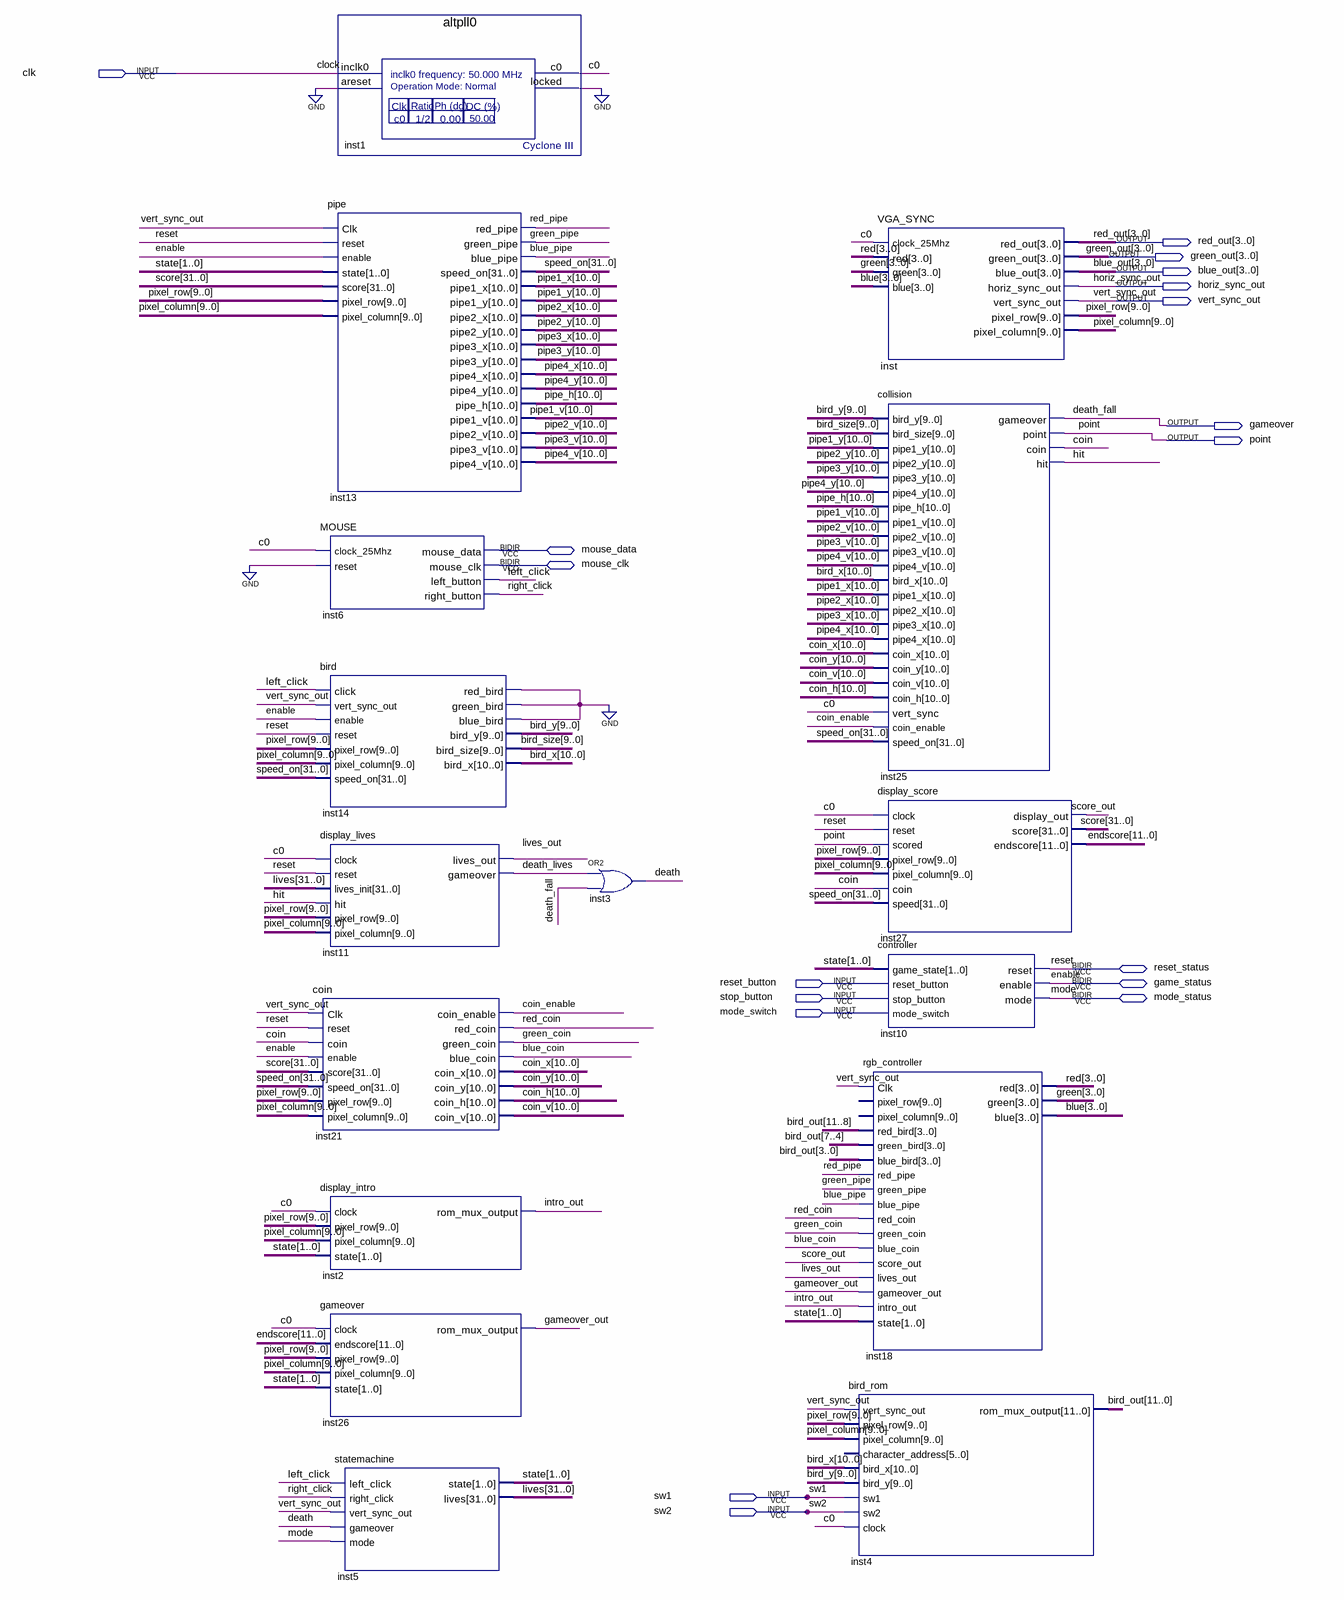
[diagram p0: schematic sheet]
// Quartus schematic game.bdf as structural Verilog: 16 symbols, 18 pins
module game (
  input  clk,
  input  reset_button,
  input  stop_button,
  input  mode_switch,
  input  sw1,
  input  sw2,
  inout  mouse_data,
  inout  mouse_clk,
  inout  reset_status,
  inout  game_status,
  inout  mode_status,
  output [3:0] red_out,
  output [3:0] green_out,
  output [3:0] blue_out,
  output horiz_sync_out,
  output vert_sync_out,
  output gameover,
  output point
);

  wire blue_coin, blue_pipe, c0, coin, coin_enable, death, death_lives, gameover_out, green_coin, green_pipe,
       hit, inst1_locked, inst14_red_bird, intro_out, left_click, lives_out, red_coin, red_pipe, right_click,
       score_out;
  wire [1:0] state;
  wire [3:0] blue, green, red;
  wire [9:0] bird_size, bird_y, pixel_column, pixel_row;
  wire [10:0] bird_x, coin_h, coin_v, coin_x, coin_y, pipe1_v, pipe1_x, pipe1_y, pipe2_v, pipe2_x, pipe2_y,
       pipe3_v, pipe3_x, pipe3_y, pipe4_v, pipe4_x, pipe4_y, pipe_h;
  wire [11:0] bird_out, endscore;
  wire [31:0] lives, score, speed_on;

  altpll0 inst1 (.inclk0(clk), .areset(1'b0), .c0(c0), .locked(inst1_locked));
  pipe inst13 (
    .Clk(vert_sync_out), .reset(reset_status), .enable(game_status), .state(state), .score(score),
    .pixel_row(pixel_row), .pixel_column(pixel_column), .red_pipe(red_pipe), .green_pipe(green_pipe),
    .blue_pipe(blue_pipe), .speed_on(speed_on), .pipe1_x(pipe1_x), .pipe1_y(pipe1_y), .pipe2_x(pipe2_x),
    .pipe2_y(pipe2_y), .pipe3_x(pipe3_x), .pipe3_y(pipe3_y), .pipe4_x(pipe4_x), .pipe4_y(pipe4_y),
    .pipe_h(pipe_h), .pipe1_v(pipe1_v), .pipe2_v(pipe2_v), .pipe3_v(pipe3_v), .pipe4_v(pipe4_v));
  MOUSE inst6 (
    .clock_25Mhz(c0), .reset(1'b0), .left_button(left_click), .right_button(right_click),
    .mouse_data(mouse_data), .mouse_clk(mouse_clk));
  bird inst14 (
    .click(left_click), .vert_sync_out(vert_sync_out), .enable(game_status), .reset(reset_status),
    .pixel_row(pixel_row), .pixel_column(pixel_column), .speed_on(speed_on), .red_bird(inst14_red_bird),
    .green_bird(inst14_red_bird), .blue_bird(inst14_red_bird), .bird_y(bird_y), .bird_size(bird_size),
    .bird_x(bird_x));
  display_lives inst11 (
    .clock(c0), .reset(reset_status), .lives_init(lives), .hit(hit), .pixel_row(pixel_row),
    .pixel_column(pixel_column), .lives_out(lives_out), .gameover(death_lives));
  coin inst21 (
    .Clk(vert_sync_out), .reset(reset_status), .coin(coin), .enable(game_status), .score(score),
    .speed_on(speed_on), .pixel_row(pixel_row), .pixel_column(pixel_column), .coin_enable(coin_enable),
    .red_coin(red_coin), .green_coin(green_coin), .blue_coin(blue_coin), .coin_x(coin_x), .coin_y(coin_y),
    .coin_h(coin_h), .coin_v(coin_v));
  display_intro inst2 (
    .clock(c0), .pixel_row(pixel_row), .pixel_column(pixel_column), .state(state), .rom_mux_output(intro_out));
  gameover inst26 (
    .clock(c0), .endscore(endscore), .pixel_row(pixel_row), .pixel_column(pixel_column), .state(state),
    .rom_mux_output(gameover_out));
  statemachine inst5 (
    .left_click(left_click), .right_click(right_click), .vert_sync_out(vert_sync_out), .gameover(death),
    .mode(mode_status), .state(state), .lives(lives));
  or inst3 (death, death_lives, gameover);
  VGA_SYNC inst (
    .clock_25Mhz(c0), .red(red), .green(green), .blue(blue), .red_out(red_out), .green_out(green_out),
    .blue_out(blue_out), .horiz_sync_out(horiz_sync_out), .vert_sync_out(vert_sync_out),
    .pixel_row(pixel_row), .pixel_column(pixel_column));
  collision inst25 (
    .bird_y(bird_y), .bird_size(bird_size), .pipe1_y(pipe1_y), .pipe2_y(pipe2_y), .pipe3_y(pipe3_y),
    .pipe4_y(pipe4_y), .pipe_h(pipe_h), .pipe1_v(pipe1_v), .pipe2_v(pipe2_v), .pipe3_v(pipe3_v),
    .pipe4_v(pipe4_v), .bird_x(bird_x), .pipe1_x(pipe1_x), .pipe2_x(pipe2_x), .pipe3_x(pipe3_x),
    .pipe4_x(pipe4_x), .coin_x(coin_x), .coin_y(coin_y), .coin_v(coin_v), .coin_h(coin_h), .vert_sync(c0),
    .coin_enable(coin_enable), .speed_on(speed_on), .gameover(gameover), .point(point), .coin(coin), .hit(hit));
  display_score inst27 (
    .clock(c0), .reset(reset_status), .scored(point), .pixel_row(pixel_row), .pixel_column(pixel_column),
    .coin(coin), .speed(speed_on), .display_out(score_out), .score(score), .endscore(endscore));
  controller inst10 (
    .game_state(state), .reset_button(reset_button), .stop_button(stop_button), .mode_switch(mode_switch),
    .reset(reset_status), .enable(game_status), .mode(mode_status));
  rgb_controller inst18 (
    .Clk(vert_sync_out), .red_bird(bird_out[11:8]), .green_bird(bird_out[7:4]), .blue_bird(bird_out[3:0]),
    .red_pipe(red_pipe), .green_pipe(green_pipe), .blue_pipe(blue_pipe), .red_coin(red_coin),
    .green_coin(green_coin), .blue_coin(blue_coin), .score_out(score_out), .lives_out(lives_out),
    .gameover_out(gameover_out), .intro_out(intro_out), .state(state), .red(red), .green(green), .blue(blue));  // open: pixel_row, pixel_column
  bird_rom inst4 (
    .vert_sync_out(vert_sync_out), .pixel_row(pixel_row), .pixel_column(pixel_column), .bird_x(bird_x),
    .bird_y(bird_y), .sw1(sw1), .sw2(sw2), .clock(c0), .rom_mux_output(bird_out));  // open: character_address
  // also tied to GND on the sheet: {inst1_locked, inst14_red_bird}

  // Other names for the same wires on the sheet: clock = clk; enable = game_status; death_fall = gameover;
  //   mode = mode_status; reset = reset_status
endmodule
